# Altium schematic sheet BACKUP_POWER_平板用快充&OTG.SchDoc
size A4
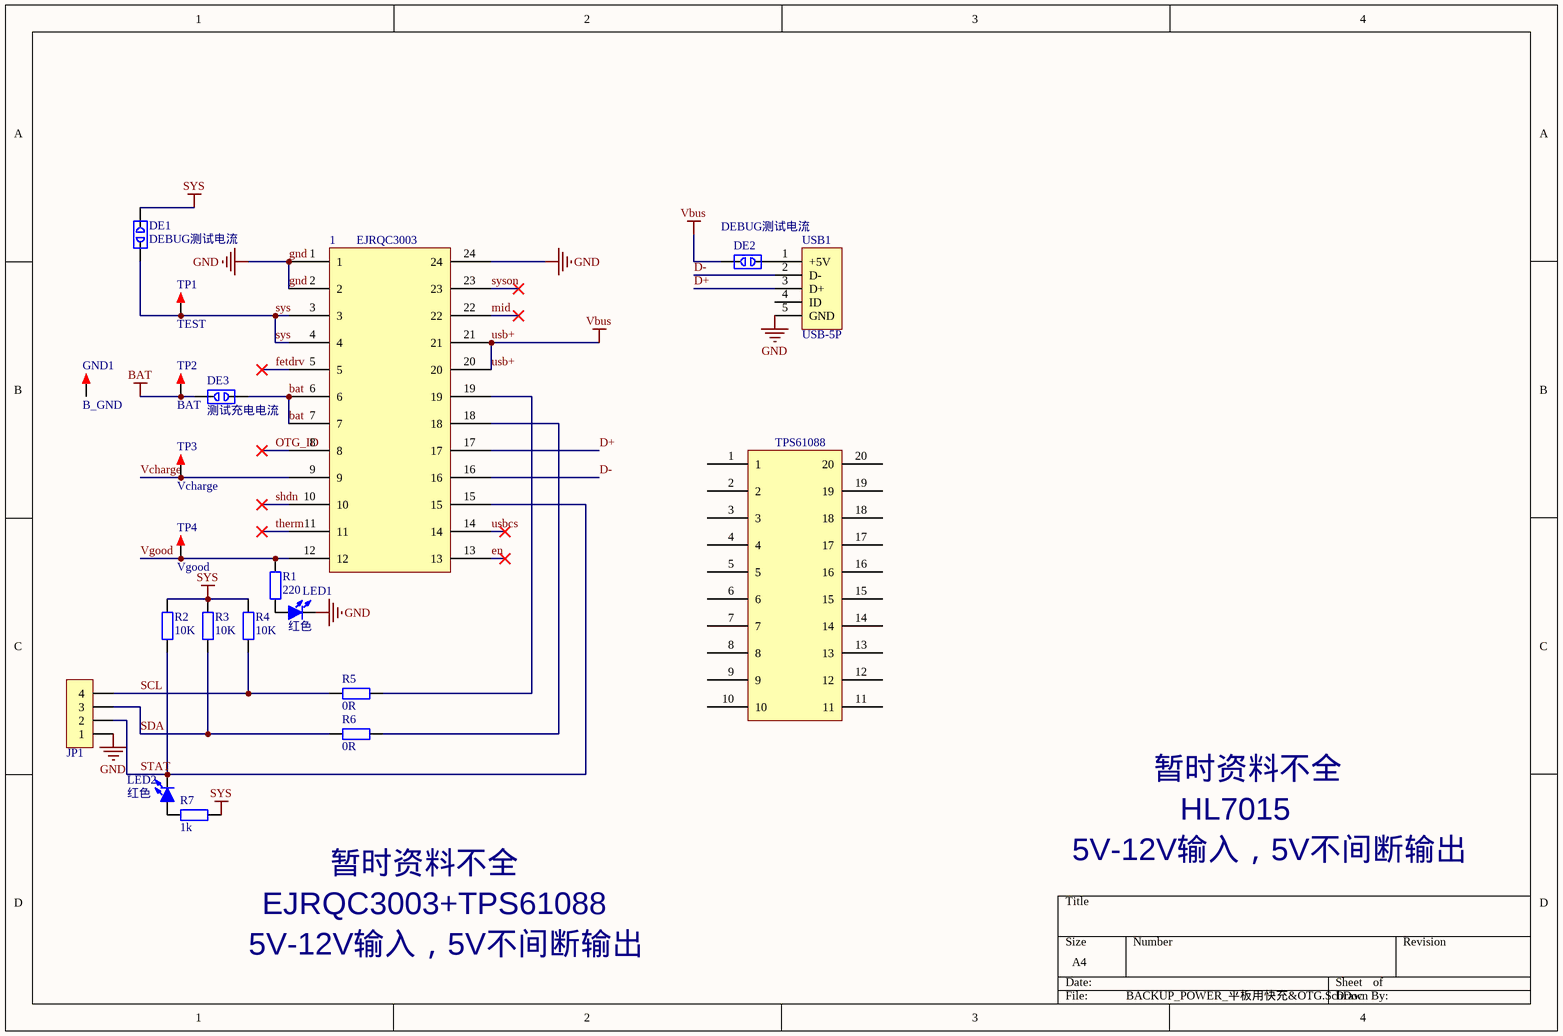
[diagram p0: BACKUP_POWER_平板用快充&OTG.SchDoc]

## Parts
1  EJRQC3003  [SOP24_L]
DE1  DEBUG测试电流  [DEBUG_A]
DE2  DEBUG测试电流  [DEBUG_A]
DE3  测试充电电流  [DEBUG_A]
GND1  B_GND  [TEST 1]
JP1  HDR-1X4  [HDR2.54-LI-4P]  (value not drawn)
LED1  红色  [LED 0805G]
LED2  红色  [LED 0805G]
R1  220  [R 0805_M]
R2  10K  [R 0805_M]
R3  10K  [R 0805_M]
R4  10K  [R 0805_M]
R5  0R  [R 0805_M]
R6  0R  [R 0805_M]
R7  1k  [R 0805_M]
TP1  TEST  [TEST 1]
TP2  BAT  [TEST 1]
TP3  Vcharge  [TEST 1]
TP4  Vgood  [TEST 1]
TPS1  TPS61088  [SOP20_L]
USB1  USB-5P  [USB-MICRO_E]

## Nets
bat: 1.6 1.7 DE3.1 DE3.2 TP2.1
gnd: 1.1 1.2 1.24 JP1.1 LED1.2(K) USB1.5(GND)
sys: 1.3 1.4 DE1.1 DE1.2 R2.2 R3.2 R4.2 R7.2 TP1.1
usb+: 1.20 1.21 DE2.1  [also labelled Vbus]
D+: 1.17 USB1.3(D+)
D-: 1.16 USB1.2(D-)
en: 1.13
fetdrv: 1.5
mid: 1.22
OTG_ID: 1.8
SCL: JP1.4 R4.1 R5.2
SDA: JP1.3 R3.1 R6.2
shdn: 1.10
STAT: 1.15 JP1.2 LED2.2(K) R2.1
syson: 1.23
therm: 1.11
usbcs: 1.14
Vcharge: 1.9 TP3.1
Vgood: 1.12 R1.2 TP4.1
Net1_18: 1.18 R6.1
Net1_19: 1.19 R5.1
NetDE2_2: DE2.2 USB1.1(+5V)
NetLED1_1: LED1.1(A) R1.1
NetLED2_1: LED2.1(A) R7.1

Not connected (* = marked no-connect by the designer): GND1 1; TPS1 1 2 3 4 5 6 7 8 9 10 11 12 13 14 15 16 17 18 19 20; USB1 4(ID)

## Notes on the sheet
- 暂时资料不全
- HL7015
- EJRQC3003+TPS61088
- 5V-12V输入，5V不间断输出

## Library data of the parts
1 = 24
DE1-DE3 = DEBUG: 调试断点焊盘; 版权归属: 源创客; BOM名称: 调试断点焊盘; 学习资源: www.ooocke.com
GND1 TP1-TP4 = TEST: 测试点; 版权归属: 源创客; BOM名称: 测试点; 学习资源: www.ooocke.com
JP1 = Header 4: 4P接插件; 版权归属: 源创客; BOM名称: 4P接插件; 学习资源: www.ooocke.com
LED1 LED2 = LED-SMD: 贴片LED; 版权归属: 源创客; BOM名称: 贴片LED; 学习资源: www.ooocke.com
R1-R7 = R: 贴片电阻; 版权归属: 源创客; BOM名称: 贴片电阻; 学习资源: www.ooocke.com
TPS1 = 20
USB1 = USB-5P: 微型USB母座; 版权归属: 源创客; BOM名称: 微型USB母座; 学习资源: www.ooocke.com